# EAGLE design Diversity2 (EAGLE 6.5.0)
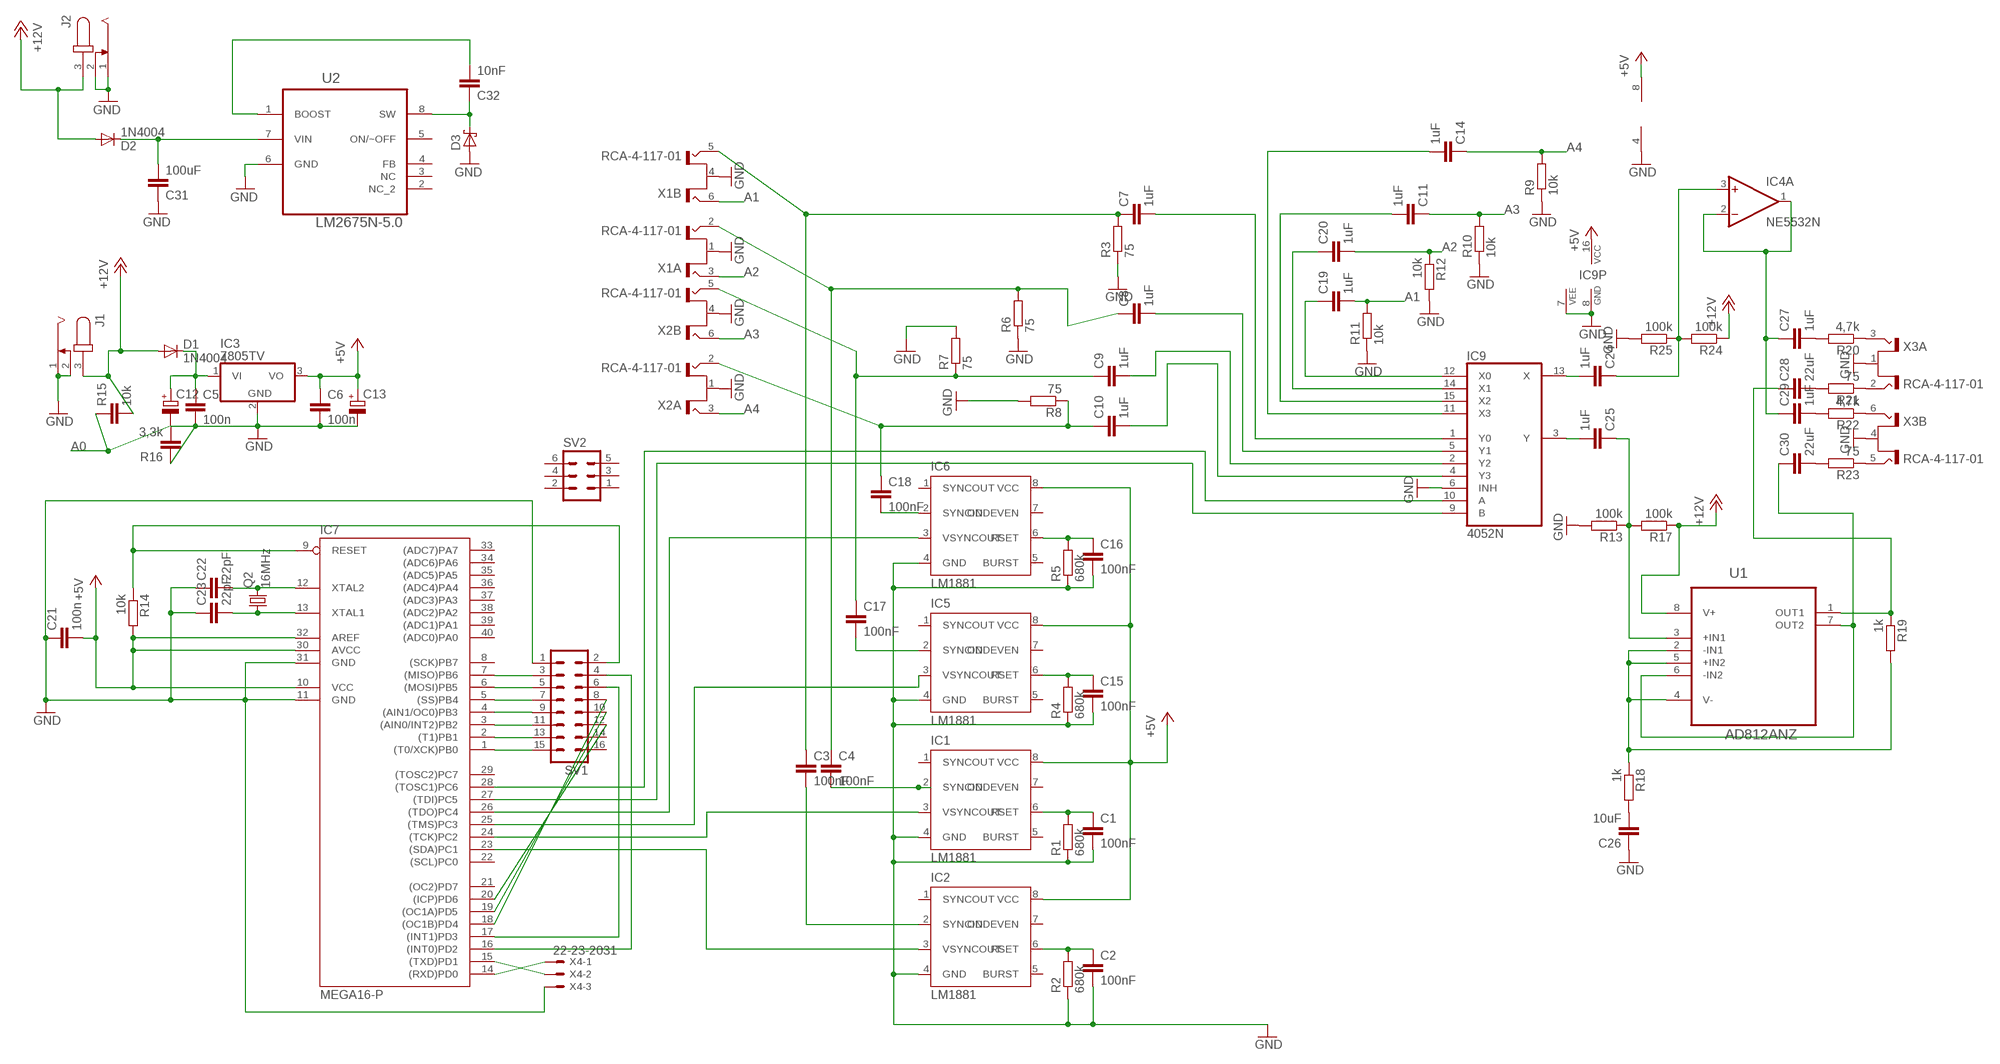
[diagram p0: schematic, sheet 1]

## Parts
C1  100nF  C2.5/2  [C2.5-2]
C2  100nF  C2.5/2  [C2.5-2]
C3  100nF  C2.5/2  [C2.5-2]
C4  100nF  C2.5/2  [C2.5-2]
C5  100n  C2.5/2  [C2.5-2]
C6  100n  C2.5/2  [C2.5-2]
C7  1uF  C2.5/2  [C2.5-2]
C8  1uF  C2.5/2  [C2.5-2]
C9  1uF  C2.5/2  [C2.5-2]
C10  1uF  C2.5/2  [C2.5-2]
C11  1uF  C2.5/2  [C2.5-2]
C12  CPOL-EUE3.5-8  [E3,5-8]
C13  CPOL-EUE2.5-5  [E2,5-5]
C14  1uF  C2.5/2  [C2.5-2]
C15  100nF  C2.5/2  [C2.5-2]
C16  100nF  C2.5/2  [C2.5-2]
C17  100nF  C2.5/2  [C2.5-2]
C18  100nF  C2.5/2  [C2.5-2]
C19  1uF  C2.5/2  [C2.5-2]
C20  1uF  C2.5/2  [C2.5-2]
C21  100n  C2.5/2  [C2.5-2]
C22  22pF  C2.5/2  [C2.5-2]
C23  22pF  C2.5/2  [C2.5-2]
C24  1uF  C2.5/2  [C2.5-2]
C25  1uF  C2.5/2  [C2.5-2]
C26  10uF  C2.5/2  [C2.5-2]
C27  1uF  C2.5/2  [C2.5-2]
C28  22uF  C2.5/2  [C2.5-2]
C29  1uF  C2.5/2  [C2.5-2]
C30  22uF  C2.5/2  [C2.5-2]
C31  100uF  C2.5/2  [C2.5-2]
C32  10nF  C2.5/2  [C2.5-2]
D1  1N4004  [DO41-10]
D2  1N4004  [DO41-10]
D3  SCHOTTKY-DIODECB417-15  [CB417-15]
IC1  LM1881  [DIL08]
IC2  LM1881  [DIL08]
IC3  7805TV  [TO220V]
IC4  NE5532N  [DIL08]
IC5  LM1881  [DIL08]
IC6  LM1881  [DIL08]
IC7  MEGA16-P  [DIL40]
IC9  4052N  [DIL16]
J1  JACK-PLUG0  [SPC4077]
J2  JACK-PLUG0  [SPC4077]
Q2  16MHz  CRYSTALHC49U-V  [HC49U-V]
R1  680k  R-EU_0207/7  [0207/7]
R2  680k  R-EU_0207/7  [0207/7]
R3  75  R-EU_0207/7  [0207/7]
R4  680k  R-EU_0207/7  [0207/7]
R5  680k  R-EU_0207/7  [0207/7]
R6  75  R-EU_0207/7  [0207/7]
R7  75  R-EU_0207/7  [0207/7]
R8  75  R-EU_0207/7  [0207/7]
R9  10k  R-EU_0207/7  [0207/7]
R10  10k  R-EU_0207/7  [0207/7]
R11  10k  R-EU_0207/7  [0207/7]
R12  10k  R-EU_0207/7  [0207/7]
R13  100k  R-EU_0207/7  [0207/7]
R14  10k  R-EU_0207/7  [0207/7]
R15  10k  C2.5/2  [C2.5-2]
R16  3,3k  C2.5/2  [C2.5-2]
R17  100k  R-EU_0207/7  [0207/7]
R18  1k  R-EU_0207/7  [0207/7]
R19  1k  R-EU_0207/7  [0207/7]
R20  4,7k  R-EU_0207/7  [0207/7]
R21  75  R-EU_0207/7  [0207/7]
R22  4,7k  R-EU_0207/7  [0207/7]
R23  75  R-EU_0207/7  [0207/7]
R24  100k  R-EU_0207/7  [0207/7]
R25  100k  R-EU_0207/7  [0207/7]
SV1  ML16  [ML16]
SV2  ML6L  [ML6L]
U1  AD812ANZ  [DIP254P762X533-8]
U2  LM2675N-5.0  [DIP254P762X508-8]
X1  RCA-4-117-01  [RCA-4-117-01]
X2  RCA-4-117-01  [RCA-4-117-01]
X3  RCA-4-117-01  [RCA-4-117-01]
X4  22-23-2031  [22-23-2031]

## Nets
+5V: C6.1 C13.+ C21.2 IC1.8(VCC) IC2.8(VCC) IC3.3(VO) IC4.8(P:V+) IC5.8(VCC) IC6.8(VCC) IC7.10(VCC) IC7.30(AVCC) IC7.32(AREF) IC9.16(VCC) R14.2
+12V: D1.A D2.A J1.3 J2.3 R15.2 R17.1 R24.1 U1.8(V+)
A0: R15.1 R16.2
A1: C19.2 R11.2 X1.6(B:T2)
A2: C20.2 R12.1 X1.3(A:T2)
A3: C11.1 R10.2 X2.6(B:T2)
A4: C14.1 R9.2 X2.3(A:T2)
GND: C1.2 C2.2 C5.2 C6.2 C12.- C13.- C15.2 C16.2 C21.1 C22.1 C23.1 C26.1 C31.1 D3.A IC1.4(GND) IC2.4(GND) IC3.2(GND) IC4.4(P:V-) IC5.4(GND) IC6.4(GND) IC7.11(GND) IC7.31(GND) IC9.6(INH) IC9.7(VEE) IC9.8(GND) J1.1 J1.2 J2.1 J2.2 R1.1 R2.1 R3.1 R4.1 R5.1 R6.1 R7.2 R8.2 R9.1 R10.1 R11.1 R12.2 R13.2 R16.1 R25.2 SV1.1 U2.6(GND) X1.1(A:S) X1.4(B:S) X2.1(A:S) X2.4(B:S) X3.1(A:S) X3.4(B:S) X4.3
N$1: IC1.3(VSYNCOUT) IC7.24((TCK)PC2)
N$2: IC2.3(VSYNCOUT) IC7.23((SDA)PC1)
N$3: C4.1 C8.1 R6.2 X1.2(A:T1)
N$4: C4.2 IC1.2(SYNCIN)
N$5: C3.2 IC2.2(SYNCIN)
N$6: C7.2 IC9.1(Y0)
N$7: C3.1 C7.1 R3.2 X1.5(B:T1)
N$8: C5.1 C12.+ D1.C IC3.1(VI)
N$9: C2.1 IC2.6(RSET) R2.2
N$10: C1.1 IC1.6(RSET) R1.2
N$11: C8.2 IC9.5(Y1)
N$12: C9.2 IC9.2(Y2)
N$13: C25.2 IC9.3(Y)
N$14: IC5.3(VSYNCOUT) IC7.25((TMS)PC3)
N$15: IC6.3(VSYNCOUT) IC7.26((TDO)PC4)
N$16: C11.2 IC9.15(X2)
N$17: C16.1 IC6.6(RSET) R5.2
N$18: C15.1 IC5.6(RSET) R4.2
N$19: C17.2 IC5.2(SYNCIN)
N$20: C9.1 C17.1 R7.1 X2.5(B:T1)
N$21: IC7.27((TDI)PC5) IC9.9(B)
N$22: C18.2 IC6.2(SYNCIN)
N$23: C10.1 C18.1 R8.1 X2.2(A:T1)
N$24: IC7.1((T0/XCK)PB0) SV1.15
N$25: C10.2 IC9.4(Y3)
N$26: IC7.28((TOSC1)PC6) IC9.10(A)
N$27: C24.2 IC9.13(X)
N$28: C14.2 IC9.11(X3)
N$29: C19.1 IC9.12(X0)
N$30: C20.1 IC9.14(X1)
N$31: C25.1 R13.1 R17.2 U1.3(+IN1)
N$32: C26.2 R18.2
N$33: IC7.9(RESET) R14.1 SV1.2
N$34: C23.2 IC7.13(XTAL1) Q2.1
N$35: C22.2 IC7.12(XTAL2) Q2.2
N$36: R18.1 R19.2 U1.2(-IN1) U1.4(V-) U1.5(+IN2)
N$37: C28.1 R19.1 U1.1(OUT1)
N$38: IC7.2((T1)PB1) SV1.13
N$39: R20.1 X3.3(A:T2)
N$40: R21.1 X3.2(A:T1)
N$41: R22.1 X3.6(B:T2)
N$42: R23.1 X3.5(B:T1)
N$43: C27.2 R20.2
N$44: C28.2 R21.2
N$45: C29.2 R22.2
N$46: C30.2 R23.2
N$47: C24.1 IC4.3(A:+IN) R24.2 R25.1
N$48: C30.1 U1.6(-IN2) U1.7(OUT2)
N$49: C27.1 C29.1 IC4.1(A:OUT) IC4.2(A:-IN)
N$50: IC7.3((AIN0/INT2)PB2) SV1.11
N$51: IC7.4((AIN1/OC0)PB3) SV1.9
N$52: IC7.5((SS)PB4) SV1.7
N$53: IC7.6((MOSI)PB5) SV1.5
N$54: IC7.7((MISO)PB6) SV1.3
N$55: IC7.16((INT0)PD2) SV1.4
N$56: IC7.14((RXD)PD0) X4.1
N$57: IC7.15((TXD)PD1) X4.2
N$58: IC7.17((INT1)PD3) SV1.6
N$59: IC7.18((OC1B)PD4) SV1.8
N$60: IC7.19((OC1A)PD5) SV1.10
N$61: IC7.20((ICP)PD6) SV1.12
N$62: C32.2 U2.1(BOOST)
N$63: C31.2 D2.C U2.7(VIN)
N$64: C32.1 D3.C U2.8(SW)
Unconnected: IC1.1(SYNCOUT) IC1.5(BURST) IC1.7(ODDEVEN) IC2.1(SYNCOUT) IC2.5(BURST) IC2.7(ODDEVEN) IC4.5(B:+IN) IC4.6(B:-IN) IC4.7(B:OUT) IC5.1(SYNCOUT) IC5.5(BURST) IC5.7(ODDEVEN) IC6.1(SYNCOUT) IC6.5(BURST) IC6.7(ODDEVEN) IC7.8((SCK)PB7) IC7.21((OC2)PD7) IC7.22((SCL)PC0) IC7.29((TOSC2)PC7) IC7.33((ADC7)PA7) IC7.34((ADC6)PA6) IC7.35((ADC5)PA5) IC7.36((ADC4)PA4) IC7.37((ADC3)PA3) IC7.38((ADC2)PA2) IC7.39((ADC1)PA1) IC7.40((ADC0)PA0) SV1.14 SV1.16 SV2.1 SV2.2 SV2.3 SV2.4 SV2.5 SV2.6 U2.2(NC_2) U2.3(NC) U2.4(FB) U2.5(ON/~OFF)

## Library data of the parts
C1-C11 C14-C32 R15 R16 = capacitor-wima:C: CAPACITOR naming: grid - package width
C12 C13 = rcl:CPOL-EU: POLARIZED CAPACITOR, European symbol
D1 D2 = diode:1N4004: DIODE general purpose rectifier, 1 A
D3 = diode:SCHOTTKY-DIODE: Schottky Diode
IC1 IC2 IC5 IC6 = lm1881:LM1881
IC3 = linear:78*: Positive VOLTAGE REGULATOR Source: http://cache.national.com/ds/LM/LM78L05.pdf http://www.fairchildsemi.com/ds/LM/LM7805.pdf
IC4 = linear:NE5532: AUDIO AMPLIFIER
IC7 = atmel:MEGA16-P: MICROCONTROLLER 16 Kbytes FLASH 1 kbytes SRAM 512 bytes EEPROM USART 8-channel 10 bit ADC Source: avr.lbr; MPN: ATMEGA16-16PU; OC_FARNELL: 9171142; OC_NEWARK: 01M6885
IC9 = 40xx:4052: Dual 4-channel ANALOG MULTIPLEXER
J1 J2 = con-jack:JACK-PLUG: DC POWER JACK Power Jack, DC, Right Angle, Through Hole, Rated 5A at 16VDC, PC Terminals Distributor: Farnell (www.Farnell.de) Drawing: 84N1161.pdf / 84N1162.pdf Manufacturer: SPC Technology (www.spctechnology.com) Type: SPC4077 / SPC 4078; OC_FARNELL: unknown; OC_NEWARK: unknown
Q2 = adafruit:CRYSTAL: CRYSTAL; OC_FARNELL: 1666969; OC_NEWARK: unknown
R1-R14 R17-R25 = resistor:R-EU_: RESISTOR, European symbol
SV1 = con-harting-ml:ML16: HARTING; OC_FARNELL: unknown; OC_NEWARK: unknown
SV2 = con-harting-ml:ML6: HARTING; OC_FARNELL: unknown; OC_NEWARK: unknown
U1 = ADI-Phase-2:AD812ANZ: Low Power Op Amp; MPN: AD812ANZ; OC_FARNELL: 1424069; OC_NEWARK: 59K6382; PACKAGE: DIP-8; SUPPLIER: Analog Devices
U2 = NSC_By_element14_Batch_1.1:LM2675N-5.0: IC, STEP-DOWN REGULATOR; MPN: LM2675N-5.0; OC_FARNELL: 9489819; OC_NEWARK: 41K4149; PACKAGE: 8-DIP; SUPPLIER: NationalSemiconductor
X1-X3 = con-conrad:RCA-4-117-01: Cinch-Anschlussplatte 72385 Gold, Rot, Weiß BKL Electronic Conrad Bestellnummer : 736910 - 62 Source: Data sheet <http://www.produktinfo.conrad.com/datenblaetter/725000-749999/736910-da-01-en-Cinch_Anschlussplatte_4polig.pdf>
X4 = con-molex:22-23-2031: .100" (2.54mm) Center Header - 3 Pin; MF: MOLEX; MPN: 22-23-2031; OC_FARNELL: 1462950; OC_NEWARK: 30C0862

## Board
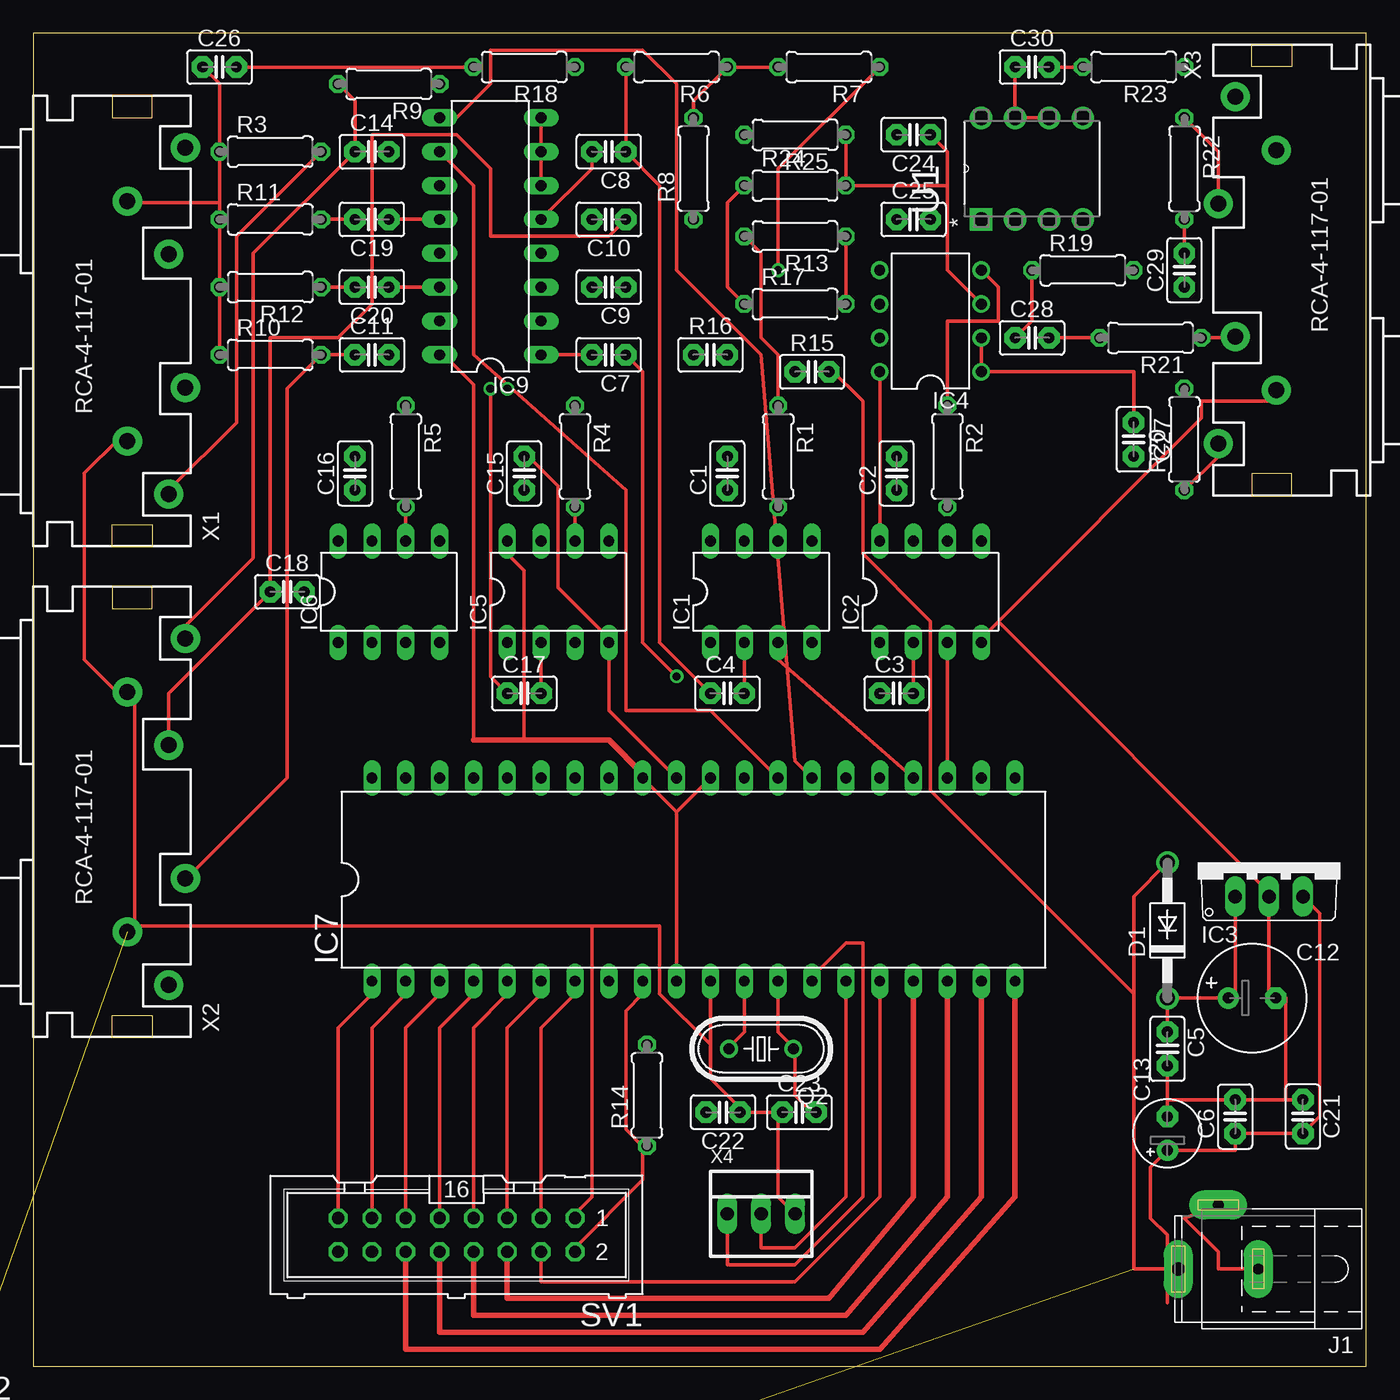
[diagram p1: board, top side]
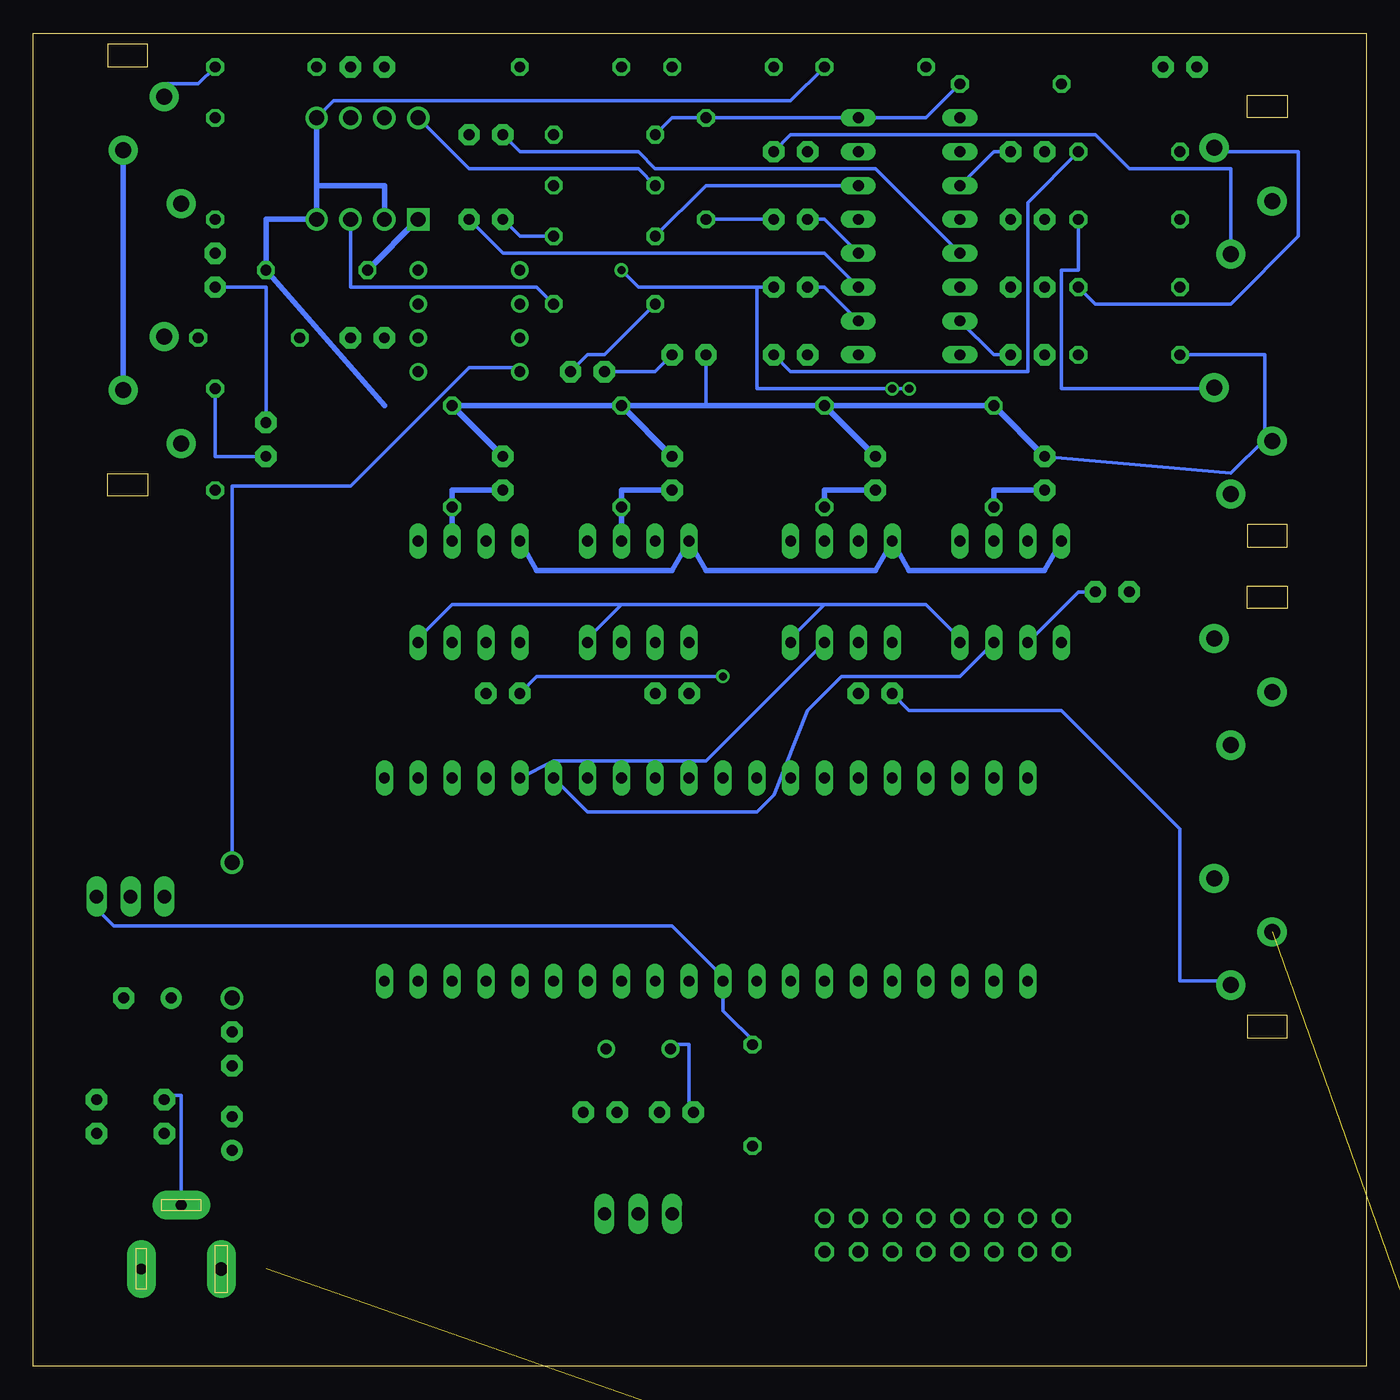
[diagram p2: board, bottom side, seen from below]

Size 100 x 100 mm. Coordinates in mm from the lower left corner, seen from the top.
Outline: 0,0 100,0 100,100 0,100 0,0
Copper layers (1*16): Top 0.035mm / dielectric 1.5mm / Bottom 0.035mm
Design rules "default": minimum track width 10mil, minimum drill 24mil, track to track 8mil, track to pad 8mil, pad to pad 8mil, via to via 8mil, smd to smd 8mil, copper to edge 40mil, drill to drill 8mil, minimum pad ring 10mil, minimum via ring 8mil, stop-mask expansion 4mil, vias tented up to drill 0mil, thermal gap 10mil

### Footprints (pad centres in the part's own frame; a part is rotated, then mirrored left to right if it is on the bottom)
C2.5-2 = drill 0.813 pad 1.6 octagon: 1 -1.27,0; 2 1.27,0
E3,5-8 = drill 0.813 pad 1.6: + -1.778,0 | drill 0.813 pad 1.6 octagon: - 1.778,0
E2,5-5 = drill 0.813 pad 1.6: + -1.27,0 | drill 0.813 pad 1.6 octagon: - 1.27,0
DO41-10 = drill 1.118: A 5.08,0; C -5.08,0
CB417-15 = drill 1.397 long: A 7.62,0; C -7.62,0
DIL08 = drill 0.813 long: 1 -3.81,-3.81; 2 -1.27,-3.81; 3 1.27,-3.81; 4 3.81,-3.81; 5 3.81,3.81; 6 1.27,3.81; 7 -1.27,3.81; 8 -3.81,3.81
TO220V = drill 1.016 long: 1 -2.54,-2.54; 2 0,-2.54; 3 2.54,-2.54
DIL08' = drill 0.813 pad 1.27: 1 -3.81,-3.81; 2 -1.27,-3.81; 3 1.27,-3.81; 4 3.81,-3.81; 5 3.81,3.81; 6 1.27,3.81; 7 -1.27,3.81; 8 -3.81,3.81
DIL40 = drill 0.813 long: 1 -24.13,-7.62; 2 -21.59,-7.62; 3 -19.05,-7.62; 4 -16.51,-7.62; 5 -13.97,-7.62; 6 -11.43,-7.62; 7 -8.89,-7.62; 8 -6.35,-7.62; 9 -3.81,-7.62; 10 -1.27,-7.62; 11 1.27,-7.62; 12 3.81,-7.62; 13 6.35,-7.62; 14 8.89,-7.62; 15 11.43,-7.62; 16 13.97,-7.62; 17 16.51,-7.62; 18 19.05,-7.62; 19 21.59,-7.62; 20 24.13,-7.62; 21 24.13,7.62; 22 21.59,7.62; 23 19.05,7.62; 24 16.51,7.62; 25 13.97,7.62; 26 11.43,7.62; 27 8.89,7.62; 28 6.35,7.62; 29 3.81,7.62; 30 1.27,7.62; 31 -1.27,7.62; 32 -3.81,7.62; 33 -6.35,7.62; 34 -8.89,7.62; 35 -11.43,7.62; 36 -13.97,7.62; 37 -16.51,7.62; 38 -19.05,7.62; 39 -21.59,7.62; 40 -24.13,7.62
DIL16 = drill 0.813 long: 1 -8.89,-3.81; 2 -6.35,-3.81; 3 -3.81,-3.81; 4 -1.27,-3.81; 5 1.27,-3.81; 6 3.81,-3.81; 7 6.35,-3.81; 8 8.89,-3.81; 9 8.89,3.81; 10 6.35,3.81; 11 3.81,3.81; 12 1.27,3.81; 13 -1.27,3.81; 14 -3.81,3.81; 15 -6.35,3.81; 16 -8.89,3.81
SPC4077 = drill 0.8 pad 2.184 long: 1 -3,0; 2 0,-4.8 | drill 1 pad 2.184 long: 3 3,0
HC49U-V = drill 0.813: 1 -2.413,0; 2 2.413,0
0207/7 = drill 0.813 octagon: 1 -3.81,0; 2 3.81,0
ML16 = drill 0.914 octagon: 1 -8.89,-1.27; 2 -8.89,1.27; 3 -6.35,-1.27; 4 -6.35,1.27; 5 -3.81,-1.27; 6 -3.81,1.27; 7 -1.27,-1.27; 8 -1.27,1.27; 9 1.27,-1.27; 10 1.27,1.27; 11 3.81,-1.27; 12 3.81,1.27; 13 6.35,-1.27; 14 6.35,1.27; 15 8.89,-1.27; 16 8.89,1.27
ML6L = drill 0.914 octagon: 1 -2.54,-1.27; 2 -2.54,1.27; 3 0,-1.27; 4 0,1.27; 5 2.54,-1.27; 6 2.54,1.27
DIP254P762X533-8 = drill 1.118 square: 1 -7.62,7.62 | drill 1.118: 2 -7.62,5.08; 3 -7.62,2.54; 4 -7.62,0; 5 0,0; 6 0,2.54; 7 0,5.08; 8 0,7.62
DIP254P762X508-8 = drill 1.118 square: 1 -7.62,7.62 | drill 1.118: 2 -7.62,5.08; 3 -7.62,2.54; 4 -7.62,0; 5 0,0; 6 0,2.54; 7 0,5.08; 8 0,7.62
RCA-4-117-01 = drill 1.2 pad 2.184: 1 9,3.1; 2 5,0; 3 13,-1.25; 4 -9,3.1; 5 -13,0; 6 -5,-1.25
22-23-2031 = drill 1 long: 1 -2.54,0; 2 0,0; 3 2.54,0

### Placement (x,y rotation side)
C1  52.07,66.99 90 top
C2  64.77,66.99 90 top
C3  64.77,50.48 0 top
C4  52.07,50.48 0 top
C5  85.09,23.81 270 top
C6  90.17,18.73 90 top
C7  43.18,75.88 180 top
C8  43.18,91.12 180 top
C9  43.18,80.96 180 top
C10  43.18,86.04 180 top
C11  25.4,75.88 0 top
C12  91.44,27.62 0 top
C13  85.09,17.46 90 top
C14  25.4,91.12 0 top
C15  36.83,66.99 90 top
C16  24.13,66.99 90 top
C17  36.83,50.48 0 top
C18  19.05,58.1 0 top
C19  25.4,86.04 180 top
C20  25.4,80.96 180 top
C21  95.25,18.73 270 top
C22  51.75,19.05 180 top
C23  57.47,19.05 0 top
C24  66.04,92.39 180 top
C25  66.04,86.04 0 top
C26  13.97,97.47 0 top
C27  82.55,69.53 270 top
C28  74.93,77.15 0 top
C29  86.36,82.23 90 top
C30  74.93,97.47 0 top
C31  -19.05,-46.99 0 top  (outside the outline)
C32  -31.75,-63.5 0 top  (outside the outline)
D1  85.09,32.7 90 top
D2  -15.24,-39.37 0 top  (outside the outline)
D3  -24.13,-71.12 0 top  (outside the outline)
IC1  54.61,58.1 0 top
IC2  67.31,58.1 0 top
IC3  92.71,37.78 0 top
IC4  NE5532N  [DIL08']  67.31,78.42 90 top
IC5  39.37,58.1 0 top
IC6  26.67,58.1 0 top
IC7  49.53,36.51 0 top
IC9  34.29,84.77 90 top
J1  88.9,7.3 180 top
J2  -10.16,-24.13 0 top  (outside the outline)
Q2  54.61,23.81 180 top
R1  55.88,68.26 270 top
R2  68.58,68.26 270 top
R3  17.78,91.12 0 top
R4  40.64,68.26 270 top
R5  27.94,68.26 270 top
R6  48.26,97.47 180 top
R7  59.69,97.47 180 top
R8  49.53,89.85 90 top
R9  26.67,96.2 180 top
R10  17.78,75.88 0 top
R11  17.78,86.04 0 top
R12  17.78,80.96 180 top
R13  57.15,84.77 180 top
R14  46.04,20.32 90 top
R15  58.42,74.61 0 top
R16  50.8,75.88 0 top
R17  57.15,79.69 0 top
R18  36.83,97.47 180 top
R19  78.74,82.23 0 top
R20  86.36,69.53 90 top
R21  83.82,77.15 180 top
R22  86.36,89.85 270 top
R23  82.55,97.47 180 top
R24  57.15,88.58 0 top
R25  57.15,92.39 180 top
SV1  31.75,9.84 180 top
SV2  1.27,-13.97 0 top  (outside the outline)
U1  78.74,93.66 90 top
U2  -25.4,-54.61 0 top  (outside the outline)
X1  10.16,78.42 90 top
X2  10.16,41.59 90 top
X3  90.17,82.23 270 top
X4  54.61,11.43 0 top

### Tracks (layer width: path | path; a pad name or v marks a point on that pad's centre or on a via)
+5V
  Top 0.254: IC3.3 96.52,33.97 96.52,18.73 C21.2 C6.1 90.17,16.19 C13.+ 83.82,14.92 83.82,11.11 85.09,9.84 85.09,4.76 | IC7.10 48.26,41.59 | 48.26,41.59 IC7.32 | 48.26,41.59 IC7.30 | 33.02,46.99 33.02,73.66 30.48,76.2 IC9.16 | 36.83,46.99 36.83,59.69 35.56,60.96 IC5.8 | IC2.8 IC4.8 63.5,74.93
  Top 0.406: IC7.32 45.72,44.45 43.18,46.99 36.83,46.99 33.02,46.99
  Bottom 0.254: IC3.3 95.25,34.29 93.98,33.02 52.07,33.02 48.26,29.21 IC7.10 48.26,26.67 45.72,24.13 R14.2
  Bottom 0.406: IC6.8 24.13,59.69 34.29,59.69 IC5.8 36.83,59.69 49.53,59.69 IC1.8 52.07,59.69 62.23,59.69 IC2.8
+12V  (2 unrouted)
  Top 0.254: R24.1 52.07,87.31 52.07,80.96 R17.1 | D1.A 82.55,35.24 82.55,27.94 | 82.55,27.94 82.55,7.3 J1.3 | 82.55,27.94 67.31,43.18 67.31,55.88 62.23,60.96 62.23,72.39 59.69,74.93 R15.2
  Bottom 0.254: R17.1 57.15,75.88 58.42,75.88 R15.2 | U1.8 67.31,89.85 54.61,89.85 R24.1 | D1.A 85.09,66.04 76.2,66.04 67.31,74.93 63.5,74.93
A0
  Bottom 0.254: R16.2 53.34,74.61 R15.1
A1
  Top 0.254: C19.2 R11.2
  Bottom 0.254: R11.2 21.59,82.23 22.86,82.23 22.86,73.34 11.43,73.34 X1.6
A2
  Top 0.254: C20.2 R12.1
  Bottom 0.254: R12.1 20.32,79.69 10.16,79.69 5.08,84.77 5.08,91.12 11.43,91.12 X1.3
A3
  Top 0.254: C11.1 R10.2 19.05,73.34 19.05,44.13 11.43,36.51 X2.6
A4
  Top 0.254: R9.2 24.13,94.93 C14.1 16.51,83.5 16.51,60.64 11.43,55.56 X2.3
GND  (5 unrouted)
  Top 0.254: 7.62,33.02 7.62,50.48 X2.1 6.35,50.48 3.81,53.02 3.81,66.99 6.35,69.53 X1.4 | 7.62,33.02 7.62,32.7 X2.4 7.62,33.02 | R10.1 R12.2 R11.1 13.97,87.31 | 13.97,87.31 R3.1 13.97,96.2 C26.1 | 13.97,87.31 7.62,87.31 X1.1 | R7.2 R6.1 49.53,94.93 R8.2 | IC9.8 IC9.7 IC9.6 | J1.2 86.36,11.11 88.9,8.57 88.9,7.3 J1.1 | C5.2 85.09,20 | 85.09,20 C13.- | 85.09,20 C6.2 93.98,20 | 93.98,20 C21.1 | 93.98,20 93.98,27.62 C12.- 92.71,27.62 IC3.2 92.71,35.56 72.39,55.88 | IC4.4 72.39,80.96 72.39,78.42 68.58,78.42 R2.1 | R13.2 54.61,83.5 54.61,77.15 55.88,75.88 R1.1 | IC7.31 43.18,49.21 IC5.4 43.18,54.61 39.37,58.42 39.37,66.04 36.83,68.58 C15.2 | 55.88,19.05 53.34,19.05 | 72.39,55.88 71.12,54.61 IC2.4 | 72.39,55.88 87.63,71.12 87.63,72.39 92.71,72.39 X3.1 | 50.8,24.13 50.8,21.59 53.34,19.05 | 50.8,24.13 IC7.11 | 53.34,19.05 C22.1 | 41.91,33.02 46.99,33.02 46.99,27.94 50.8,24.13 | 41.91,33.02 7.62,33.02 | 41.91,33.02 41.91,12.7 40.64,11.43 SV1.1 | X4.3 55.88,12.7 55.88,19.05 | 55.88,19.05 C23.1
  Bottom 0.254: 7.62,69.53 7.62,75.88 R10.1 | R13.2 49.53,88.58 IC9.6 | R25.2 52.07,93.66 R8.2 IC9.8 33.02,93.66 R9.1 | 49.53,72.07 R16.1 | 7.62,69.53 10.16,66.99 C16.2 | 7.62,69.53 X1.4 | 71.12,53.34 IC2.4 71.12,54.61 68.58,57.15 55.88,57.15 | 40.64,57.15 33.02,57.15 30.48,54.61 IC6.4 | 40.64,57.15 43.18,54.61 IC5.4 | 55.88,57.15 58.42,54.61 IC1.4 | 40.64,57.15 55.88,57.15 | 50.8,29.21 IC7.11 | J1.2 88.9,20.32 90.17,20.32 C6.2
  Bottom 0.406: R1.1 49.53,72.07 R4.1 | R4.1 R5.1 C16.2 | C2.2 R2.1 R1.1 | C1.2 R1.1 | C15.2 R4.1 | X3.4 X3.1
N$1
  Top 0.254: IC7.24 55.88,53.02 IC1.3
N$2
  Top 0.254: IC2.3 IC7.23
N$3
  Top 0.254: R6.2 C8.1 46.99,88.58 46.99,54.29 C4.1
  Bottom 0.254: X1.2 10.16,89.85 17.78,89.85 20.32,92.39 43.18,92.39 C8.1
N$4
  Top 0.254: C4.2 IC1.2
N$5
  Top 0.254: C3.2 IC2.2
N$6
  Top 0.254: C7.2 IC9.1
N$7  (via drill 0.61)
  Top 0.254: R3.2 15.24,84.77 15.24,70.8 10.16,65.72 X1.5 | v48.26,51.75 45.72,54.29 45.72,74.61 C7.1
  Bottom 0.254: C3.1 62.23,51.75 v48.26,51.75 | R3.2 25.4,87.31 25.4,74.61 43.18,74.61 C7.1
N$8
  Top 0.254: C5.1 D1.C C12.+ 90.17,27.62 IC3.1
N$9
  Bottom 0.406: IC2.6 R2.2 68.58,65.72 C2.1
N$10
  Bottom 0.406: C1.1 55.88,65.72 R1.2 IC1.6
N$11
  Top 0.254: IC9.5 41.91,89.85 C8.2
N$12
  Bottom 0.254: IC9.2 40.64,80.96 C9.2
N$13
  Bottom 0.254: IC9.3 40.64,83.5 64.77,83.5 C25.2
N$14
  Bottom 0.254: IC5.3 49.53,45.4 60.96,45.4 IC7.25
N$15
  Bottom 0.254: IC6.3 30.48,51.75 39.37,51.75 41.91,49.21 44.45,42.86 45.72,41.59 58.42,41.59 IC7.26
N$16
  Bottom 0.254: IC9.15 27.94,75.88 C11.2
N$17
  Top 0.254: R5.2 IC6.6
  Bottom 0.406: R5.2 27.94,65.72 C16.1
N$18
  Top 0.254: R4.2 IC5.6
  Bottom 0.406: C15.1 40.64,65.72 R4.2
N$19
  Top 0.254: C17.2 IC5.2
N$20  (via drill 0.61)
  Top 0.254: R7.1 55.88,89.85 v55.88,82.23 | v34.29,73.34 34.29,51.75 C17.1
  Bottom 0.254: v55.88,82.23 54.61,80.96 45.72,80.96 | C9.1 45.72,80.96 | 45.72,80.96 45.72,73.34 v35.56,73.34 v34.29,73.34 | C17.1 34.29,49.21 22.86,49.21 13.97,40.32 13.97,28.89 10.16,28.89 X2.5
N$21
  Top 0.254: IC9.9 31.75,93.66 34.29,96.2 34.29,98.74 45.72,98.74 48.26,96.2 48.26,82.23 54.61,75.88 57.15,45.4 IC7.27
N$22
  Bottom 0.254: IC6.2 21.59,58.1 C18.2
N$23
  Top 0.254: X2.2 10.16,50.48 C18.1 17.78,77.15 22.86,77.15 25.4,79.69 25.4,92.39 31.75,92.39 34.29,89.85 34.29,84.77 43.18,84.77 C10.1
  Bottom 0.254: C10.1 R8.1 | 10.16,46.67 X2.2
N$24
  Top 0.254: SV1.15 22.86,25.4 25.4,27.94 IC7.1
N$25
  Bottom 0.254: IC9.4 40.64,86.04 C10.2
N$26
  Top 0.254: IC9.10 33.02,88.58 33.02,75.88 44.45,65.72 44.45,49.21 50.8,49.21 IC7.28
N$27
  Bottom 0.254: IC9.13 36.83,89.85 53.34,89.85 54.61,91.12 63.5,91.12 C24.2
N$28
  Bottom 0.254: IC9.11 27.94,91.12 C14.2
N$29
  Top 0.254: C19.1 IC9.12
N$30
  Top 0.254: C20.1 IC9.14
N$31
  Top 0.254: R13.1 R17.2
  Bottom 0.254: C25.1 63.5,84.77 R13.1 | U1.3 76.2,80.96 62.23,80.96 R17.2
N$32
  Top 0.254: C26.2 R18.2
N$33
  Top 0.254: 45.72,16.51 44.45,17.78 44.45,26.67 45.72,27.94 IC7.9 | 45.72,16.51 45.72,13.97 40.64,8.89 SV1.2 | 45.72,16.51 R14.1
N$34
  Top 0.254: IC7.13 55.88,25.08 57.15,23.81 Q2.1 57.15,24.13 57.15,20.32 58.42,19.05 C23.2
N$35
  Top 0.254: IC7.12 53.34,25.08 52.07,23.81 Q2.2
  Bottom 0.254: C22.2 50.8,19.05 50.8,24.13 52.07,24.13 Q2.2
N$36
  Bottom 0.254: R18.1 43.18,94.93 77.47,94.93 U1.5
  Bottom 0.406: 73.66,72.07 R19.2 82.55,86.04 U1.4 | U1.2 73.66,88.58 78.74,88.58 U1.4 | U1.5 U1.4
N$37
  Top 0.254: C28.1 74.93,78.42 R19.1
  Bottom 0.406: U1.1 R19.1
N$38
  Top 0.254: SV1.13 25.4,25.4 27.94,27.94 IC7.2
N$39
  Top 0.254: R20.1 88.9,68.26 X3.3
N$40
  Top 0.254: R21.1 90.17,77.15 X3.2
N$41
  Top 0.254: R22.1 88.9,91.12 88.9,87.31 X3.6
N$42
  Bottom 0.254: R23.1 87.63,96.2 90.17,96.2 X3.5
N$43
  Bottom 0.254: R20.2 86.36,68.26 C27.2
N$44
  Top 0.254: C28.2 R21.2
N$45
  Top 0.254: C29.2 R22.2
N$46
  Top 0.254: C30.2 R23.2
N$47
  Top 0.254: R25.1 R24.2 68.58,88.58 | IC4.3 68.58,82.23 68.58,88.58 | 68.58,88.58 68.58,91.12 C24.1
N$48
  Top 0.254: C30.1 U1.7 U1.6
N$49
  Top 0.254: IC4.2 IC4.1 82.55,74.61 C27.1
  Bottom 0.254: C27.1 82.55,80.96 C29.1
N$50
  Top 0.254: SV1.11 27.94,25.4 30.48,27.94 IC7.3
N$51
  Top 0.254: SV1.9 30.48,25.4 33.02,27.94 IC7.4
N$52
  Top 0.254: SV1.7 33.02,25.4 35.56,27.94 IC7.5
N$53
  Top 0.254: SV1.5 35.56,25.4 38.1,27.94 IC7.6
N$54
  Top 0.254: SV1.3 38.1,25.4 40.64,27.94 IC7.7
N$55
  Top 0.254: IC7.16 63.5,12.7 57.15,6.35 38.1,6.35 SV1.4 38.1,8.89
N$56
  Top 0.254: X4.1 52.07,7.62 57.15,7.62 62.23,12.7 62.23,31.75 60.96,31.75 58.42,29.21 IC7.14
N$57
  Top 0.254: IC7.15 60.96,12.7 57.15,8.89 54.61,8.89 X4.2
N$58
  Top 0.406: IC7.17 66.04,12.7 59.69,5.08 35.56,5.08 SV1.6
N$59
  Top 0.406: IC7.18 68.58,12.7 60.96,3.81 33.02,3.81 SV1.8
N$60
  Top 0.254: 30.48,8.89 SV1.10
  Top 0.406: IC7.19 71.12,12.7 62.23,2.54 30.48,2.54 SV1.10
N$61
  Top 0.406: IC7.20 73.66,12.7 63.5,1.27 27.94,1.27 SV1.12
N$62  (1 unrouted)
N$63  (2 unrouted)
N$64  (2 unrouted)